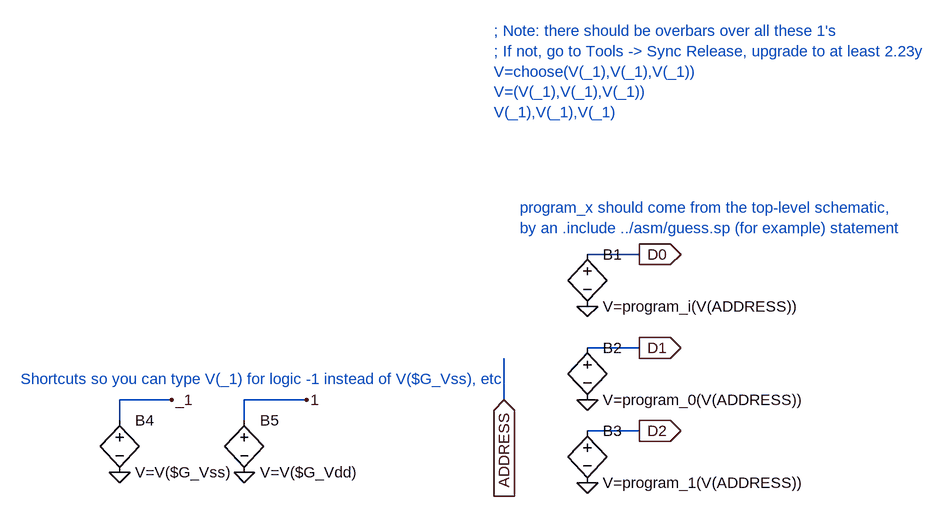
[diagram p0: schematic swrom-fast.asc]
swrom-fast.asc, the LTspice schematic file:
Version 4
SHEET 1 880 720
WIRE 176 64 96 64
WIRE 176 208 96 208
WIRE -544 288 -624 288
WIRE -336 288 -432 288
WIRE -32 288 -32 224
WIRE -624 320 -624 288
WIRE -432 320 -432 288
WIRE 176 336 96 336
FLAG 176 64 D0
IOPIN 176 64 Out
FLAG 176 208 D1
IOPIN 176 208 Out
FLAG 176 336 D2
IOPIN 176 336 Out
FLAG -32 288 ADDRESS
IOPIN -32 288 In
FLAG 96 144 0
FLAG 96 288 0
FLAG 96 416 0
FLAG -624 400 0
FLAG -544 288 _1
FLAG -432 400 0
FLAG -336 288 1
SYMBOL bv 96 48 R0
SYMATTR InstName B1
SYMATTR Value V=program_i(V(ADDRESS))
SYMBOL bv 96 192 R0
SYMATTR InstName B2
SYMATTR Value V=program_0(V(ADDRESS))
SYMBOL bv 96 320 R0
SYMATTR InstName B3
SYMATTR Value V=program_1(V(ADDRESS))
SYMBOL bv -624 304 R0
SYMATTR InstName B4
SYMATTR Value V=V($G_Vss)
SYMBOL bv -432 304 R0
SYMATTR InstName B5
SYMATTR Value V=V($G_Vdd)
TEXT -776 256 Left 0 ;Shortcuts so you can type V(_1) for logic -1 instead of V($G_Vss), etc.
TEXT -48 -280 Left 0 ;; Note: there should be overbars over all these 1's\n; If not, go to Tools -> Sync Release, upgrade to at least 2.23y\nV=choose(V(_1),V(_1),V(_1))\nV=(V(_1),V(_1),V(_1))\nV(_1),V(_1),V(_1)
TEXT -8 -8 Left 0 ;program_x should come from the top-level schematic,\nby an .include ../asm/guess.sp (for example) statement

The netlist it stands for:
* swrom-fast.asc
B1 D0 0 V=program_i(V(ADDRESS))
B2 D1 0 V=program_0(V(ADDRESS))
B3 D2 0 V=program_1(V(ADDRESS))
B4 _1 0 V=V($G_Vss)
B5 1 0 V=V($G_Vdd)
* Shortcuts so you can type V(_1) for logic -1 instead of V($G_Vss), etc.
* ; Note: there should be overbars over all these 1's
* ; If not, go to Tools -> Sync Release, upgrade to at least 2.23y
* V=choose(V(_1),V(_1),V(_1))
* V=(V(_1),V(_1),V(_1))
* V(_1),V(_1),V(_1)
* program_x should come from the top-level schematic,
* by an .include ../asm/guess.sp (for example) statement
.backanno
.end